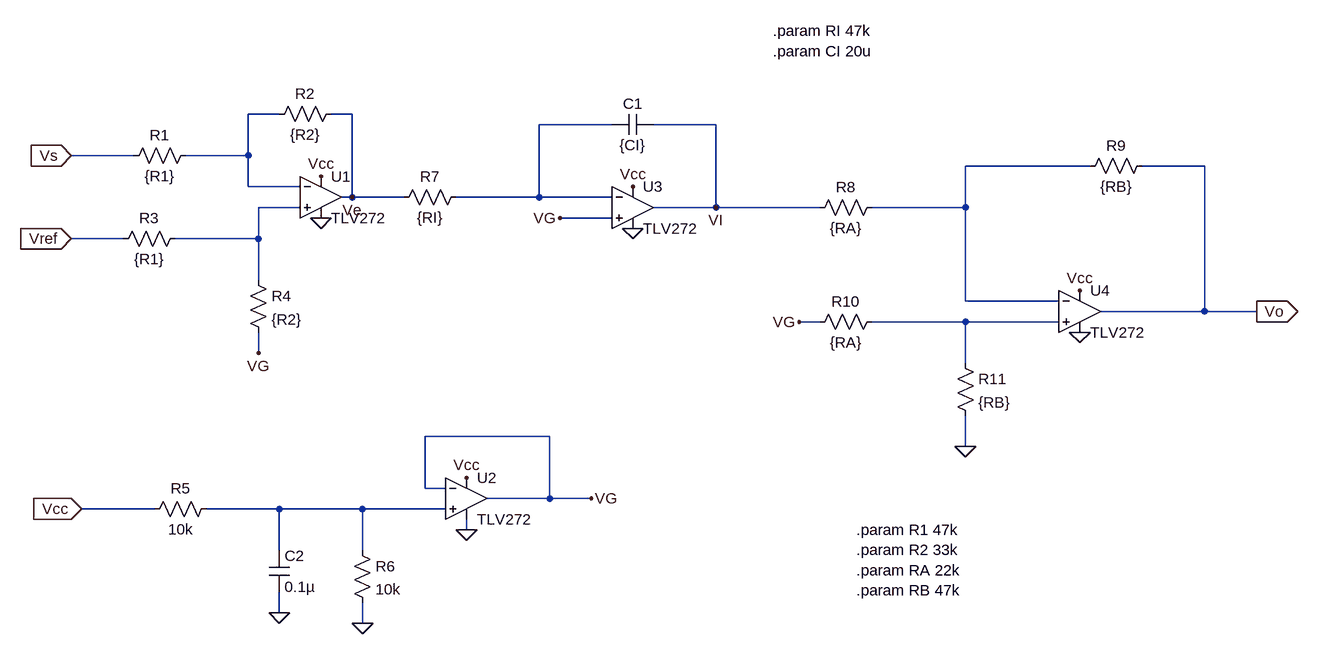
[diagram p0: schematic I-Compensator_Circuit in LTspice.asc]
I-Compensator_Circuit in LTspice.asc, the LTspice schematic file:
Version 4
SHEET 1 1640 1140
WIRE 48 96 0 96
WIRE 160 96 128 96
WIRE 560 112 448 112
WIRE 720 112 624 112
WIRE -176 160 -272 160
WIRE 0 160 0 96
WIRE 0 160 -96 160
WIRE 1296 176 1104 176
WIRE 1472 176 1376 176
WIRE 0 208 0 160
WIRE 80 208 0 208
WIRE 160 224 160 96
WIRE 160 224 144 224
WIRE 240 224 160 224
WIRE 448 224 448 112
WIRE 448 224 320 224
WIRE 560 224 448 224
WIRE 80 240 16 240
WIRE 720 240 720 112
WIRE 720 240 624 240
WIRE 880 240 720 240
WIRE 1104 240 1104 176
WIRE 1104 240 960 240
WIRE 560 256 480 256
WIRE -192 288 -272 288
WIRE 16 288 16 240
WIRE 16 288 -112 288
WIRE 16 352 16 288
WIRE 1104 384 1104 240
WIRE 1248 384 1104 384
WIRE 1472 400 1472 176
WIRE 1472 400 1312 400
WIRE 1552 400 1472 400
WIRE 880 416 848 416
WIRE 1104 416 960 416
WIRE 1248 416 1104 416
WIRE 16 464 16 432
WIRE 1104 480 1104 416
WIRE 464 592 272 592
WIRE 1104 608 1104 560
WIRE 272 672 272 592
WIRE 304 672 272 672
WIRE 464 688 464 592
WIRE 464 688 368 688
WIRE 528 688 464 688
WIRE -144 704 -256 704
WIRE 48 704 -64 704
WIRE 176 704 48 704
WIRE 304 704 176 704
WIRE 336 736 336 720
WIRE 48 768 48 704
WIRE 176 768 176 704
WIRE 48 864 48 832
WIRE 176 880 176 848
FLAG 112 256 0
FLAG 112 192 Vcc
FLAG -272 160 Vs
IOPIN -272 160 In
FLAG -272 288 Vref
IOPIN -272 288 In
FLAG 16 464 VG
FLAG 160 224 Ve
FLAG -256 704 Vcc
IOPIN -256 704 In
FLAG 176 880 0
FLAG 336 736 0
FLAG 528 688 VG
FLAG 480 256 VG
FLAG 592 272 0
FLAG 720 240 VI
FLAG 48 864 0
FLAG 1104 608 0
FLAG 848 416 VG
FLAG 1280 432 0
FLAG 1280 368 Vcc
FLAG 1552 400 Vo
IOPIN 1552 400 Out
FLAG 592 208 Vcc
FLAG 336 656 Vcc
SYMBOL res -80 144 R90
WINDOW 0 0 56 VBottom 2
WINDOW 3 32 56 VTop 2
SYMATTR InstName R1
SYMATTR Value {R1}
SYMBOL res 144 80 R90
WINDOW 0 0 56 VBottom 2
WINDOW 3 32 56 VTop 2
SYMATTR InstName R2
SYMATTR Value {R2}
SYMBOL res -96 272 R90
WINDOW 0 0 56 VBottom 2
WINDOW 3 32 56 VTop 2
SYMATTR InstName R3
SYMATTR Value {R1}
SYMBOL res 0 336 R0
SYMATTR InstName R4
SYMATTR Value {R2}
SYMBOL OpAmps\\TLV272 112 224 R0
SYMATTR InstName U1
SYMBOL res -160 720 R270
WINDOW 0 32 56 VTop 2
WINDOW 3 0 56 VBottom 2
SYMATTR InstName R5
SYMATTR Value 10k
SYMBOL res 160 752 R0
SYMATTR InstName R6
SYMATTR Value 10k
SYMBOL OpAmps\\TLV272 336 688 R0
SYMATTR InstName U2
SYMBOL res 224 240 R270
WINDOW 0 32 56 VTop 2
WINDOW 3 0 56 VBottom 2
SYMATTR InstName R7
SYMATTR Value {RI}
SYMBOL OpAmps\\TLV272 592 240 R0
SYMATTR InstName U3
SYMBOL cap 624 96 R90
WINDOW 0 0 32 VBottom 2
WINDOW 3 32 32 VTop 2
SYMATTR InstName C1
SYMATTR Value {CI}
SYMBOL cap 32 768 R0
SYMATTR InstName C2
SYMATTR Value 0.1µ
SYMBOL res 864 256 R270
WINDOW 0 32 56 VTop 2
WINDOW 3 0 56 VBottom 2
SYMATTR InstName R8
SYMATTR Value {RA}
SYMBOL res 1280 192 R270
WINDOW 0 32 56 VTop 2
WINDOW 3 0 56 VBottom 2
SYMATTR InstName R9
SYMATTR Value {RB}
SYMBOL res 864 432 R270
WINDOW 0 32 56 VTop 2
WINDOW 3 0 56 VBottom 2
SYMATTR InstName R10
SYMATTR Value {RA}
SYMBOL res 1088 464 R0
SYMATTR InstName R11
SYMATTR Value {RB}
SYMBOL OpAmps\\TLV272 1280 400 R0
SYMATTR InstName U4
TEXT 936 736 Left 2 !.param R1 47k\n.param R2 33k\n.param RA 22k\n.param RB 47k
TEXT 808 -32 Left 2 !.param RI 47k\n.param CI 20u

The netlist it stands for:
* I-Compensator_Circuit in LTspice.asc
R1 N001 Vs {R1}
R2 Ve N001 {R2}
R3 N004 Vref {R1}
R4 N004 VG {R2}
* U1: TLV272 (symbol OpAmps\TLV272 not available, pins judged from their places): In+=N004 In-=N001 V+=Vcc V-=0 OUT=Ve
R5 Vcc N006 10k
R6 N006 0 10k
* U2: TLV272 (symbol OpAmps\TLV272 not available, pins judged from their places): In+=N006 In-=VG V+=Vcc V-=0 OUT=VG
R7 Ve N002 {RI}
* U3: TLV272 (symbol OpAmps\TLV272 not available, pins judged from their places): In+=VG In-=N002 V+=Vcc V-=0 OUT=VI
C1 VI N002 {CI}
C2 N006 0 0.1µ
R8 VI N003 {RA}
R9 N003 Vo {RB}
R10 VG N005 {RA}
R11 N005 0 {RB}
* U4: TLV272 (symbol OpAmps\TLV272 not available, pins judged from their places): In+=N005 In-=N003 V+=Vcc V-=0 OUT=Vo
.param R1 47k
.param R2 33k
.param RA 22k
.param RB 47k
.param RI 47k
.param CI 20u
.backanno
.end